# EAGLE design TINRS-SimpleMixer (EAGLE 7.7.0)
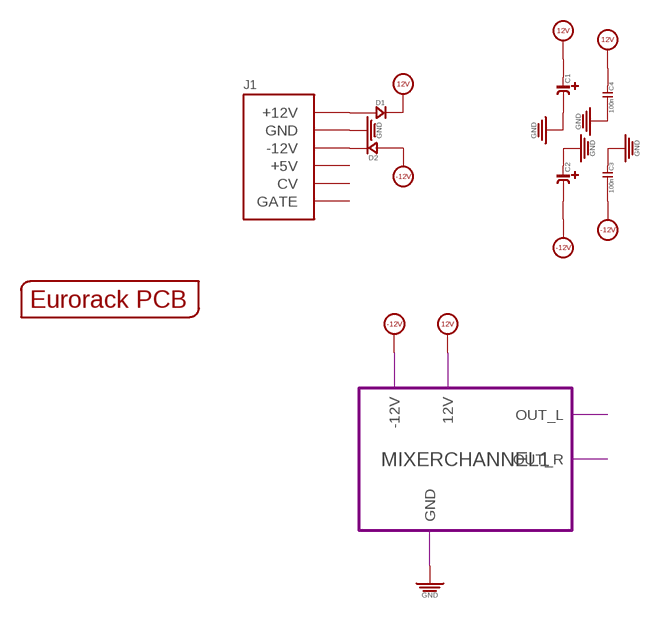
[diagram p0: schematic, sheet 1]

## Parts
C1  C-POLAR-A  [CASE-A_3216]
C2  C-POLAR-A  [CASE-A_3216]
C3  100n  C-0603  [C0603]
C4  100n  C-0603  [C0603]
D1  D-SMA  [DO-214AC]
D2  D-SMA  [DO-214AC]
J1  POWERSHROUDED  [POWER_16_SHROUDED]
PCB1  EURORACK_PCB12HP  [EURORACK12HPPCB]

## Module instances
MIXERCHANNEL1 = MIXERCHANNEL

## Nets
12V: C1.+ C4.1 D1.2(-) ; port MIXERCHANNEL1.12V
-12V: C2.- C3.2 D2.1(+) ; port MIXERCHANNEL1.-12V
GND: C1.- C2.+ C3.1 C4.2 J1.3(GND) J1.4(GND) J1.5(GND) J1.6(GND) J1.7(GND) J1.8(GND) ; port MIXERCHANNEL1.GND
N$9: D1.1(+) J1.9(+12V) J1.10(+12V)
N$10: D2.2(-) J1.1(-12V) J1.2(-12V)
Unconnected: J1.11(+5V) J1.12(+5V) J1.13(CV) J1.14(CV) J1.15(GATE) J1.16(GATE)

## Library data of the parts
C1 C2 = EurorackModularParts:C-POLAR*
C3 C4 = OPL:C*
D1 D2 = OPL:D*: DIODE
J1 = EurorackModularParts:POWER
PCB1 = EurorackModularParts:EURORACK_PCB

## Module MIXERCHANNEL
Ports: -12V(io) 12V(io) GND(io) OUT_L(io) OUT_R(io)
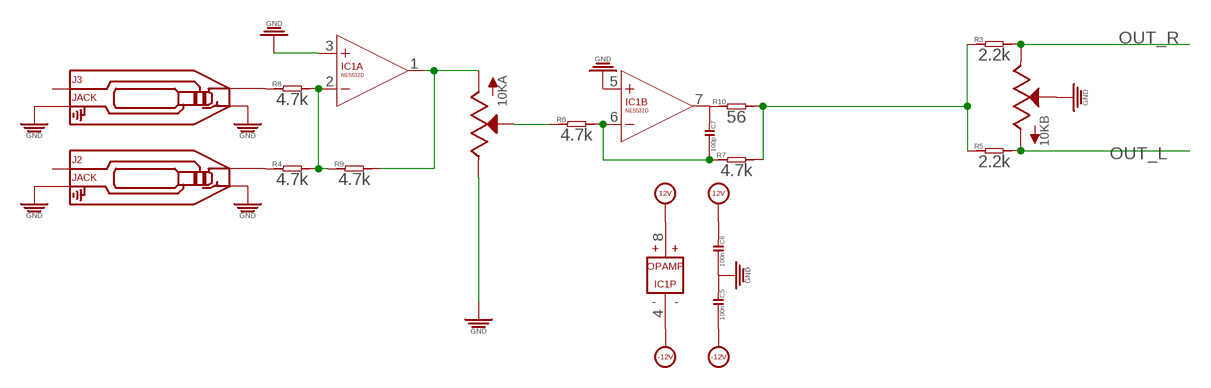
[diagram p1: schematic, module MIXERCHANNEL, sheet 1]

### Parts
10KA  POTSQUAREHOLE_SMALLKNOB  [ALPS_POT_SQUAREHOLES]
10KB  POTSQUAREHOLE_SMALLKNOB  [ALPS_POT_SQUAREHOLES]
C5  100n  C-0603  [C0603]
C6  100n  C-0603  [C0603]
C7  100p  C-0603  [C0603]
IC1  NE5532D  [SO08]
J2  JACK  AUDIO-JACK_SMALLSYMBOLNODRILL  [3.5MM-JACK-SWITCH-13MM-NOHOLES]
J3  JACK  AUDIO-JACK_SMALLSYMBOLNODRILL  [3.5MM-JACK-SWITCH-13MM-NOHOLES]
R3  2.2k  R-0603  [R0603]
R4  4.7k  R-0603  [R0603]
R5  2.2k  R-0603  [R0603]
R6  4.7k  R-0603  [R0603]
R7  4.7k  R-0603  [R0603]
R8  4.7k  R-0603  [R0603]
R9  4.7k  R-0603  [R0603]
R10  56  R-0603  [R0603]

### Nets
12V: C6.1 IC1.8(P:V+)
-12V: C5.2 IC1.4(P:V-)
GND: 10KA.P$1(E) 10KB.P$2(S) C5.1 C6.2 IC1.3(A:+IN) IC1.5(B:+IN) J2.RING_B@1(RING) J2.RING_T@3(RING) J2.SWITCH_B@1(SWITCH) J2.SWITCH_T@3(SWITCH) J3.RING_B@1(RING) J3.RING_T@3(RING) J3.SWITCH_B@1(SWITCH) J3.SWITCH_T@3(SWITCH)
N$1: C7.2 IC1.6(B:-IN) R6.2 R7.1
N$2: IC1.2(A:-IN) R4.2 R8.2 R9.1
N$3: 10KA.P$2(S) R6.1
N$4: 10KA.P$3(A) IC1.1(A:OUT) R9.2
N$5: R3.1 R5.1 R7.2 R10.2
N$10: J2.TIP_B@1(TIP) J2.TIP_T@3(TIP) R4.1
N$11: J3.TIP_B@1(TIP) J3.TIP_T@3(TIP) R8.1
N$12: IC1.7(B:OUT) R10.1
N$13: C7.1 IC1.7(B:OUT)
OUT_L: 10KB.P$3(A) R5.2
OUT_R: 10KB.P$1(E) R3.2
Unconnected: J2.SECOND_B@1(SECOND) J2.SECOND_T@3(SECOND) J3.SECOND_B@1(SECOND) J3.SECOND_T@3(SECOND)

### Library data of the parts
10KA = EurorackModularParts:POT; DESC: Level
10KB = EurorackModularParts:POT; DESC: Balance
C5-C7 = OPL:C*
IC1 = EurorackModularParts:NE5532: AUDIO AMPLIFIER
J2 = EurorackModularParts:AUDIO-JACK_SMALLSYMBOL: Switching Mono 3.5mm Audio Jack from Erthenvar.; DESC: B
J3 = EurorackModularParts:AUDIO-JACK_SMALLSYMBOL: Switching Mono 3.5mm Audio Jack from Erthenvar.; DESC: A
R3-R10 = OPL:R*

## Board
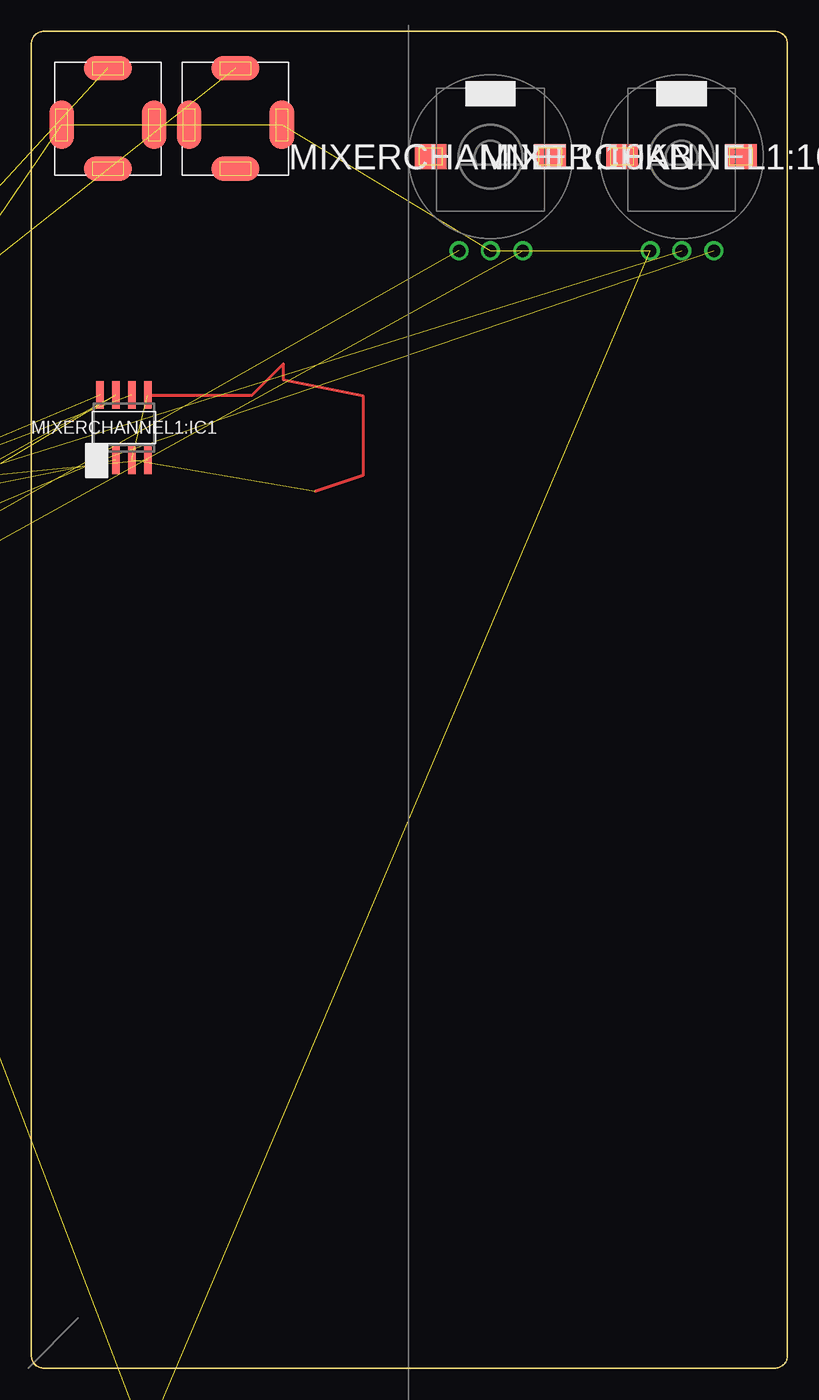
[diagram p2: board, top side]
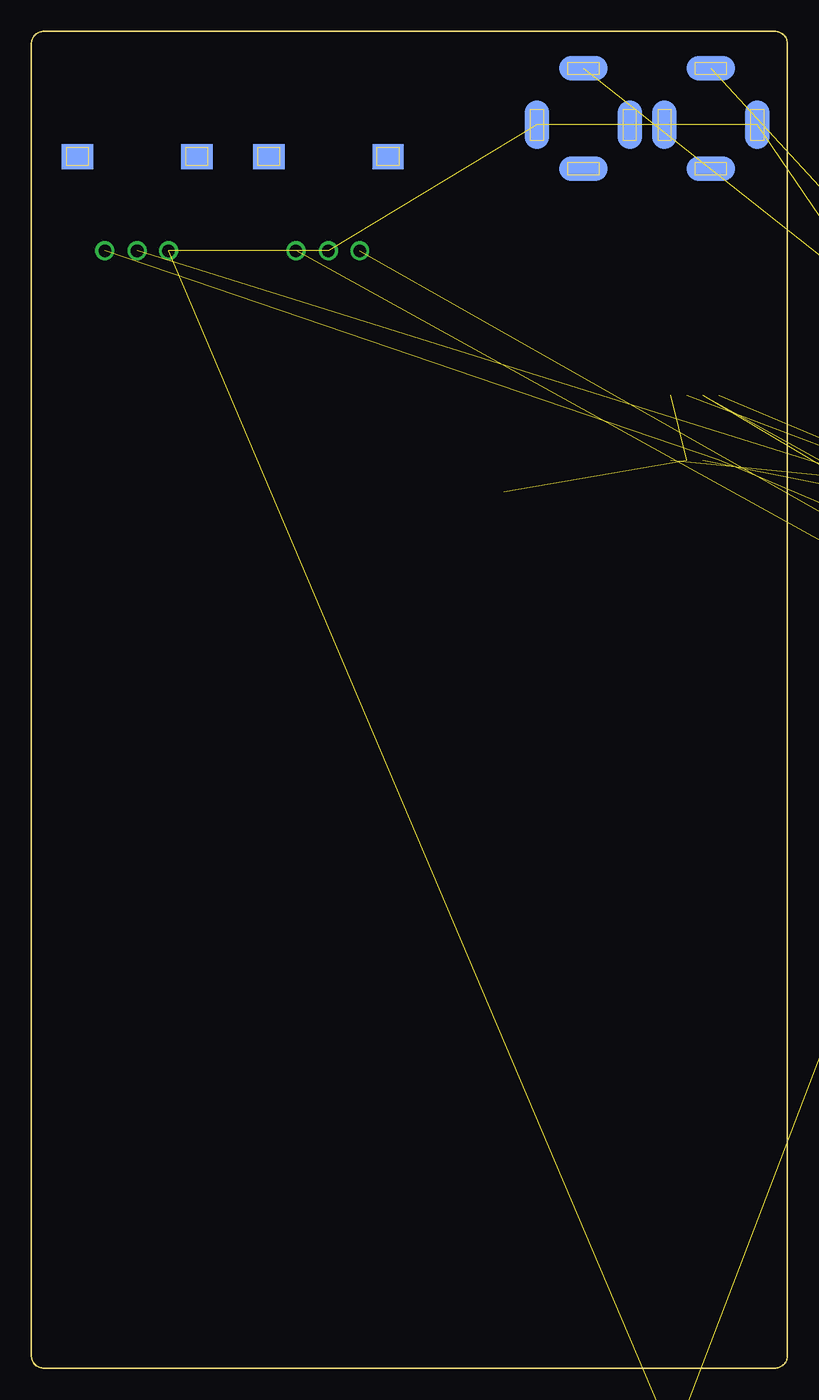
[diagram p3: board, bottom side, seen from below]

Size 60.25 x 106.5 mm. Coordinates in mm from the lower left corner, seen from the top.
Copper layers (1*16): Top 0.035mm / dielectric 1.5mm / Bottom 0.035mm
Design rules "default": minimum track width 10mil, minimum drill 24mil, track to track 8mil, track to pad 8mil, pad to pad 8mil, via to via 8mil, smd to smd 8mil, copper to edge 40mil, drill to drill 8mil, minimum pad ring 10mil, minimum via ring 8mil, stop-mask expansion 4mil, vias tented up to drill 0mil, thermal gap 10mil

### Footprints (pad centres in the part's own frame; a part is rotated, then mirrored left to right if it is on the bottom)
CASE-A_3216 = smd 1.27 x 1.27: + -1.27,0; - 1.27,0
C0603 = smd 0.889 x 0.889: 1 -0.762,0; 2 0.762,0
DO-214AC = smd 2.5 x 1.7: 1 -2,0; 2 2,0
POWER_16_SHROUDED = drill 1.016 pad 1.88 square: 1 -8.89,-1.27 | drill 1.016 pad 1.88: 2 -8.89,1.27; 3 -6.35,-1.27; 4 -6.35,1.27; 5 -3.81,-1.27; 6 -3.81,1.27; 7 -1.27,-1.27; 8 -1.27,1.27; 9 1.27,-1.27; 10 1.27,1.27; 11 3.81,-1.27; 12 3.81,1.27; 13 6.35,-1.27; 14 6.35,1.27; 15 8.89,-1.27; 16 8.89,1.27
ALPS_POT_SQUAREHOLES = drill 1: P$1 -2.5,-7.5; P$2 0,-7.5; P$3 2.58,-7.5 | smd 2.5 x 2: P$4 -4.75,0; P$5 4.75,0 | smd 2.5 x 2 bottom: P$6 -4.75,0; P$7 4.75,0
SO08 = smd 0.6 x 2.2: 1 -1.905,-2.6; 2 -0.635,-2.6; 3 0.635,-2.6; 4 1.905,-2.6; 5 1.905,2.6; 6 0.635,2.6; 7 -0.635,2.6; 8 -1.905,2.6
3.5MM-JACK-SWITCH-13MM-NOHOLES = smd 1.95 x 3.85 bottom: RING_B@1 -3.7,0; SWITCH_B@1 3.7,0 | smd 1.95 x 3.85: RING_T@3 -3.7,0; SWITCH_T@3 3.7,0 | smd 3.85 x 1.95 bottom: SECOND_B@1 0,-3.5; TIP_B@1 0,4.5 | smd 3.85 x 1.95: SECOND_T@3 0,-3.5; TIP_T@3 0,4.5
R0603 = smd 0.889 x 0.889: 1 -0.762,0; 2 0.762,0

### Placement (x,y rotation side)
C1  4.83,-17.78 0 top  (outside the outline)
C2  -1.52,-15.24 0 top  (outside the outline)
C3  -4.06,-12.7 0 top  (outside the outline)
C4  4.83,-13.97 0 top  (outside the outline)
D1  11.18,-16.51 0 top  (outside the outline)
D2  -2.79,-19.05 180 top  (outside the outline)
J1  4.83,-25.4 0 top  (outside the outline)
MIXERCHANNEL1:10KA  [ALPS_POT_SQUAREHOLES]  51.82,96.52 0 top
MIXERCHANNEL1:10KB  [ALPS_POT_SQUAREHOLES]  36.58,96.52 0 top
MIXERCHANNEL1:C5  100n  [C0603]  -16.76,69.85 0 top  (outside the outline)
MIXERCHANNEL1:C6  100n  [C0603]  -18.03,67.31 0 top  (outside the outline)
MIXERCHANNEL1:C7  100p  [C0603]  -39.62,49.53 0 top  (outside the outline)
MIXERCHANNEL1:IC1  NE5532D  [SO08]  7.37,74.93 0 top
MIXERCHANNEL1:J2  JACK  [3.5MM-JACK-SWITCH-13MM-NOHOLES]  16.26,99.06 0 top
MIXERCHANNEL1:J3  JACK  [3.5MM-JACK-SWITCH-13MM-NOHOLES]  6.1,99.06 0 top
MIXERCHANNEL1:R3  2.2k  [R0603]  -40.89,46.99 0 top  (outside the outline)
MIXERCHANNEL1:R4  4.7k  [R0603]  -32,64.77 0 top  (outside the outline)
MIXERCHANNEL1:R5  2.2k  [R0603]  -42.16,44.45 0 top  (outside the outline)
MIXERCHANNEL1:R6  4.7k  [R0603]  -33.27,62.23 0 top  (outside the outline)
MIXERCHANNEL1:R7  4.7k  [R0603]  -34.54,59.69 0 top  (outside the outline)
MIXERCHANNEL1:R8  4.7k  [R0603]  -35.81,57.15 0 top  (outside the outline)
MIXERCHANNEL1:R9  4.7k  [R0603]  -37.08,54.61 0 top  (outside the outline)
MIXERCHANNEL1:R10  56  [R0603]  -38.35,52.07 0 top  (outside the outline)
PCB1  -0.25,0 0 top

### Tracks (layer width: path | path; a pad name or v marks a point on that pad's centre or on a via)
12V  (4 unrouted)
-12V  (4 unrouted)
GND  (19 unrouted)
  Top 0.254: MIXERCHANNEL1:IC1.5 17.59,77.53 20.07,80.01 20.07,78.74 26.42,77.47 26.42,71.12 22.61,69.85
MIXERCHANNEL1:N$1  (3 unrouted)
MIXERCHANNEL1:N$2  (3 unrouted)
MIXERCHANNEL1:N$3  (1 unrouted)
MIXERCHANNEL1:N$4  (2 unrouted)
MIXERCHANNEL1:N$5  (3 unrouted)
MIXERCHANNEL1:N$10  (1 unrouted)
MIXERCHANNEL1:N$11  (1 unrouted)
MIXERCHANNEL1:N$12  (1 unrouted)
MIXERCHANNEL1:N$13  (1 unrouted)
MIXERCHANNEL1:OUT_L  (1 unrouted)
MIXERCHANNEL1:OUT_R  (1 unrouted)
N$9  (2 unrouted)
N$10  (2 unrouted)